# EAGLE design wirelessnode (EAGLE 6.5.0)
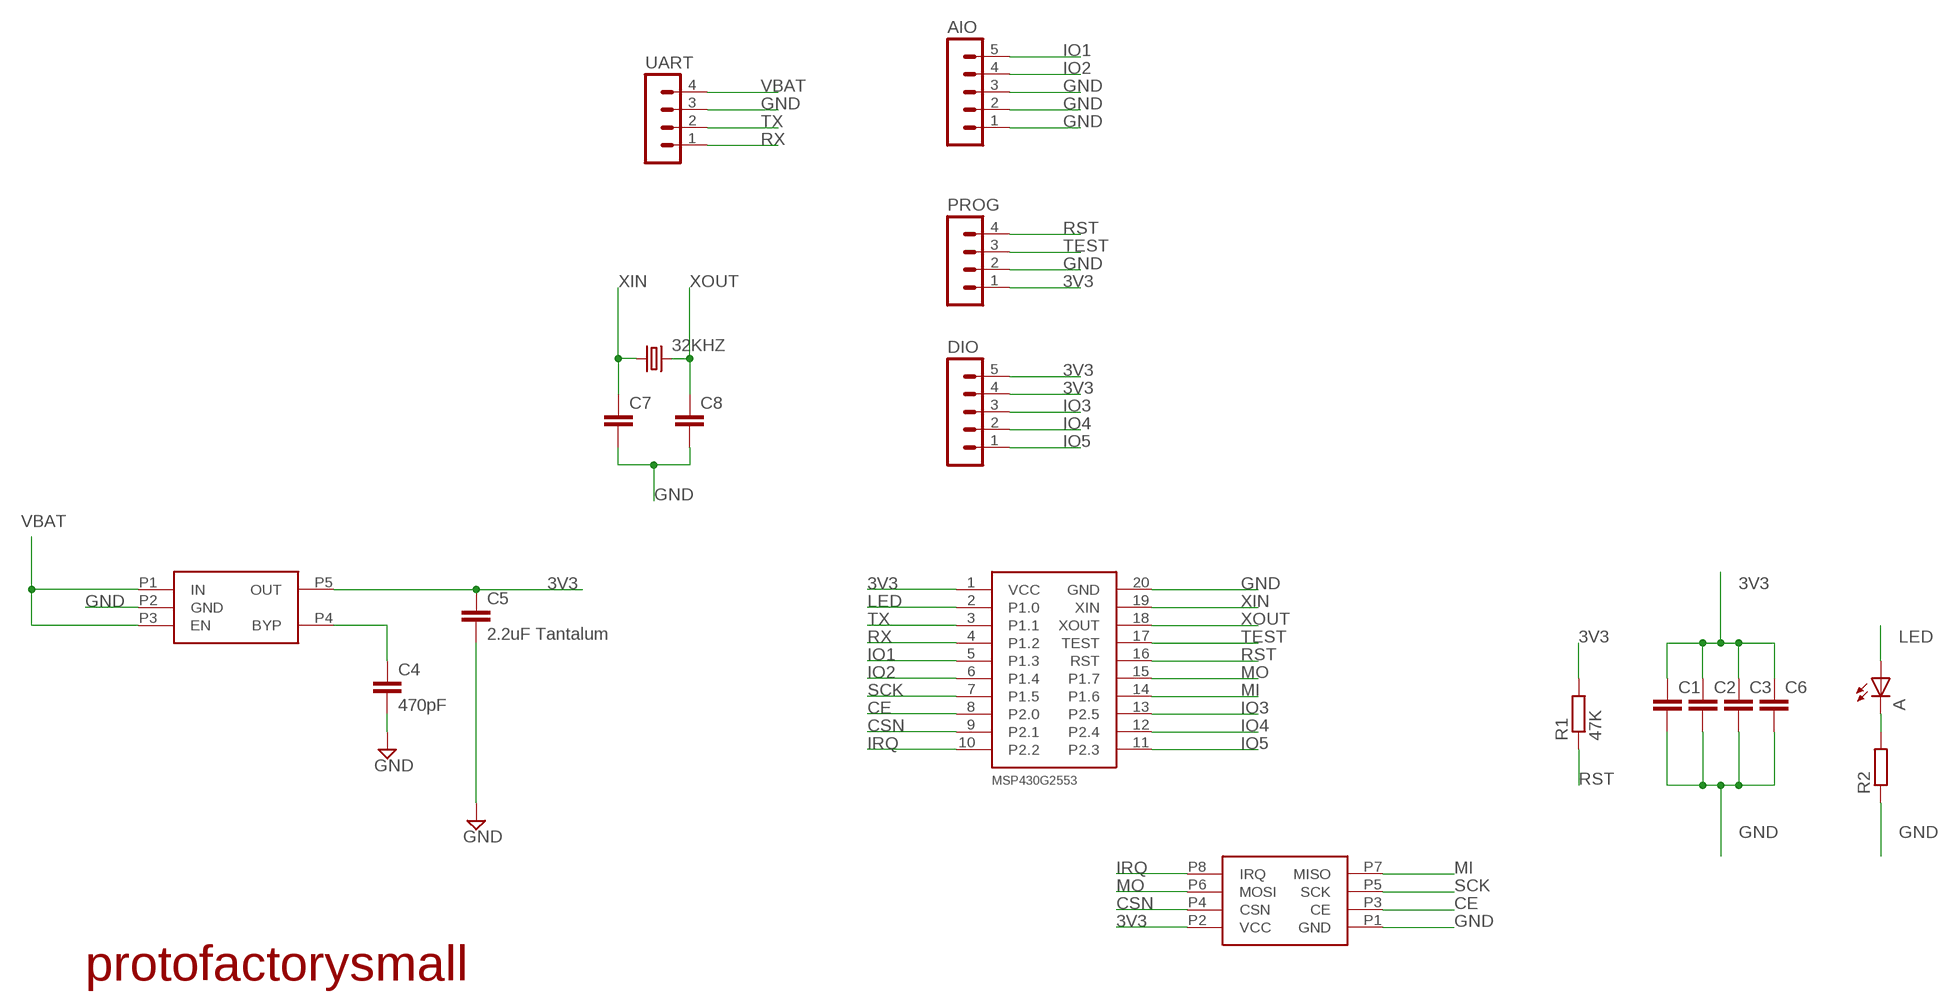
[diagram p0: schematic, sheet 1]

## Parts
32KHZ  CRYSTALTC26H  [TC26H]
A  LEDSML0603  [SML0603]
AIO  MA05-1  [MA05-1]
C1  C-EUC0603  [C0603]
C2  C-EUC0603  [C0603]
C3  C-EUC0603  [C0603]
C4  470pF  C-EUC0603  [C0603]
C5  2.2uF Tantalum  C-EUC3225  [C3225]
C6  C-EUC0603  [C0603]
C7  C-EUC0603  [C0603]
C8  C-EUC0603  [C0603]
DIO  MA05-1  [MA05-1]
MSP430G2553  MSP430G2553_20PINMSP430G2553  [DIL20]
PROG  MA04-1  [MA04-1]
R1  47K  R-EU_R0603  [R0603]
R2  R-EU_R0603  [R0603]
RF  NRF24L01NRF24L01  [NRF24L01]
U$1  SMALLPROTOLOGOLOGO  [LOGO_SMALL]
U$3  MIC5219-X.XBM5MIC5219-3.3YM5TR  [SOT-23-5]
UART  MA04-1  [MA04-1]

## Nets
3V3: C1.1 C2.1 C3.1 C5.1 C6.1 DIO.4 DIO.5 MSP430G2553.1(VCC) PROG.1 R1.2 RF.P2(VCC) U$3.P5(OUT)
CE: MSP430G2553.8(P2.0) RF.P3(CE)
CSN: MSP430G2553.9(P2.1) RF.P4(CSN)
GND: AIO.1 AIO.2 AIO.3 C1.2 C2.2 C3.2 C4.2 C5.2 C6.2 C7.2 C8.2 MSP430G2553.20(GND) PROG.2 R2.1 RF.P1(GND) U$3.P2(GND) UART.3
IO1: AIO.5 MSP430G2553.5(P1.3)
IO2: AIO.4 MSP430G2553.6(P1.4)
IO3: DIO.3 MSP430G2553.13(P2.5)
IO4: DIO.2 MSP430G2553.12(P2.4)
IO5: DIO.1 MSP430G2553.11(P2.3)
IRQ: MSP430G2553.10(P2.2) RF.P8(IRQ)
LED: A.A MSP430G2553.2(P1.0)
MI: MSP430G2553.14(P1.6) RF.P7(MISO)
MO: MSP430G2553.15(P1.7) RF.P6(MOSI)
N$2: A.C R2.2
N$3: C4.1 U$3.P4(BYP)
RST: MSP430G2553.16(RST) PROG.4 R1.1
RX: MSP430G2553.4(P1.2) UART.1
SCK: MSP430G2553.7(P1.5) RF.P5(SCK)
TEST: MSP430G2553.17(TEST) PROG.3
TX: MSP430G2553.3(P1.1) UART.2
VBAT: U$3.P1(IN) U$3.P3(EN) UART.4
XIN: 32KHZ.1 C7.1 MSP430G2553.19(XIN)
XOUT: 32KHZ.2 C8.1 MSP430G2553.18(XOUT)

## Library data of the parts
32KHZ = crystal:CRYSTAL: CRYSTAL; OC_FARNELL: unknown; OC_NEWARK: unknown
A = led:LED: LED OSRAM: - CHIPLED LG R971, LG N971, LY N971, LG Q971, LY Q971, LO R971, LY R971 LH N974, LH R974 LS Q976, LO Q976, LY Q976 LO Q996 - Hyper CHIPLED LW Q18S LB Q993, LB Q99A, LB R99A - SideLED LS A670, LO A670, LY A670, LG A670, LP A670 LB A673, LV A673, LT A673, LW A673 LH A674 LY A675 LS A676, LA A676, LO A676, LY A676, LW A676 LS A679, LY A679, LG A679 - Hyper Micro SIDELED® LS Y876, LA Y876, LO Y876, LY Y876 LT Y87S - SmartLED LW L88C, LW L88S LB L89C, LB L89S, LG L890 LS L89K, LO L89K, LY L89K LS L896, LA L896, LO L896, LY L896 - TOPLED LS T670, LO T670, LY T670, LG T670, LP T670 LSG T670, LSP T670, LSY T670, LOP T670, LYG T670 LG T671, LOG T671, LSG T671 LB T673, LV T673, LT T673, LW T673 LH T674 LS T676, LA T676, LO T676, LY T676, LB T676, LH T676, LSB T676, LW T676 LB T67C, LV T67C, LT T67C, LS T67K, LO T67K, LY T67K, LW E67C LS E67B, LA E67B, LO E67B, LY E67B, LB E67C, LV E67C, LT E67C LW T67C LS T679, LY T679, LG T679 LS T770, LO T770, LY T770, LG T770, LP T770 LB T773, LV T773, LT T773, LW T773 LH T774 LS E675, LA E675, LY E675, LS T675 LS T776, LA T776, LO T776, LY T776, LB T776 LHGB T686 LT T68C, LB T68C - Hyper Mini TOPLED® LB M676 - Mini TOPLED Santana® LG M470 LS M47K, LO M47K, LY M47K Source: http://www.osram.convergy.de LUXEON: - LUMILED® LXK2-PW12-R00, LXK2-PW12-S00, LXK2-PW14-U00, LXK2-PW14-V00 LXK2-PM12-R00, LXK2-PM12-S00, LXK2-PM14-U00 LXK2-PE12-Q00, LXK2-PE12-R00, LXK2-PE12-S00, LXK2-PE14-T00, LXK2-PE14-U00 LXK2-PB12-K00, LXK2-PB12-L00, LXK2-PB12-M00, LXK2-PB14-N00, LXK2-PB14-P00, LXK2-PB14-Q00 LXK2-PR12-L00, LXK2-PR12-M00, LXK2-PR14-Q00, LXK2-PR14-R00 LXK2-PD12-Q00, LXK2-PD12-R00, LXK2-PD12-S00 LXK2-PH12-R00, LXK2-PH12-S00 LXK2-PL12-P00, LXK2-PL12-Q00, LXK2-PL12-R00 Source: www.luxeon.com KINGBRIGHT: KA-3528ASYC Source: www.kingbright.com
AIO DIO = con-lstb:MA05-1: PIN HEADER; OC_FARNELL: unknown; OC_NEWARK: unknown
C1-C8 = rcl:C-EU: CAPACITOR, European symbol
MSP430G2553 = protofactory:MSP430G2553_20PIN
PROG UART = con-lstb:MA04-1: PIN HEADER; OC_FARNELL: unknown; OC_NEWARK: unknown
R1 R2 = rcl:R-EU_: RESISTOR, European symbol
RF = protofactory:NRF24L01
U$1 = protofactory:SMALLPROTOLOGO
U$3 = protofactory:MIC5219-X.XBM5: 3.3V LDO

## Board
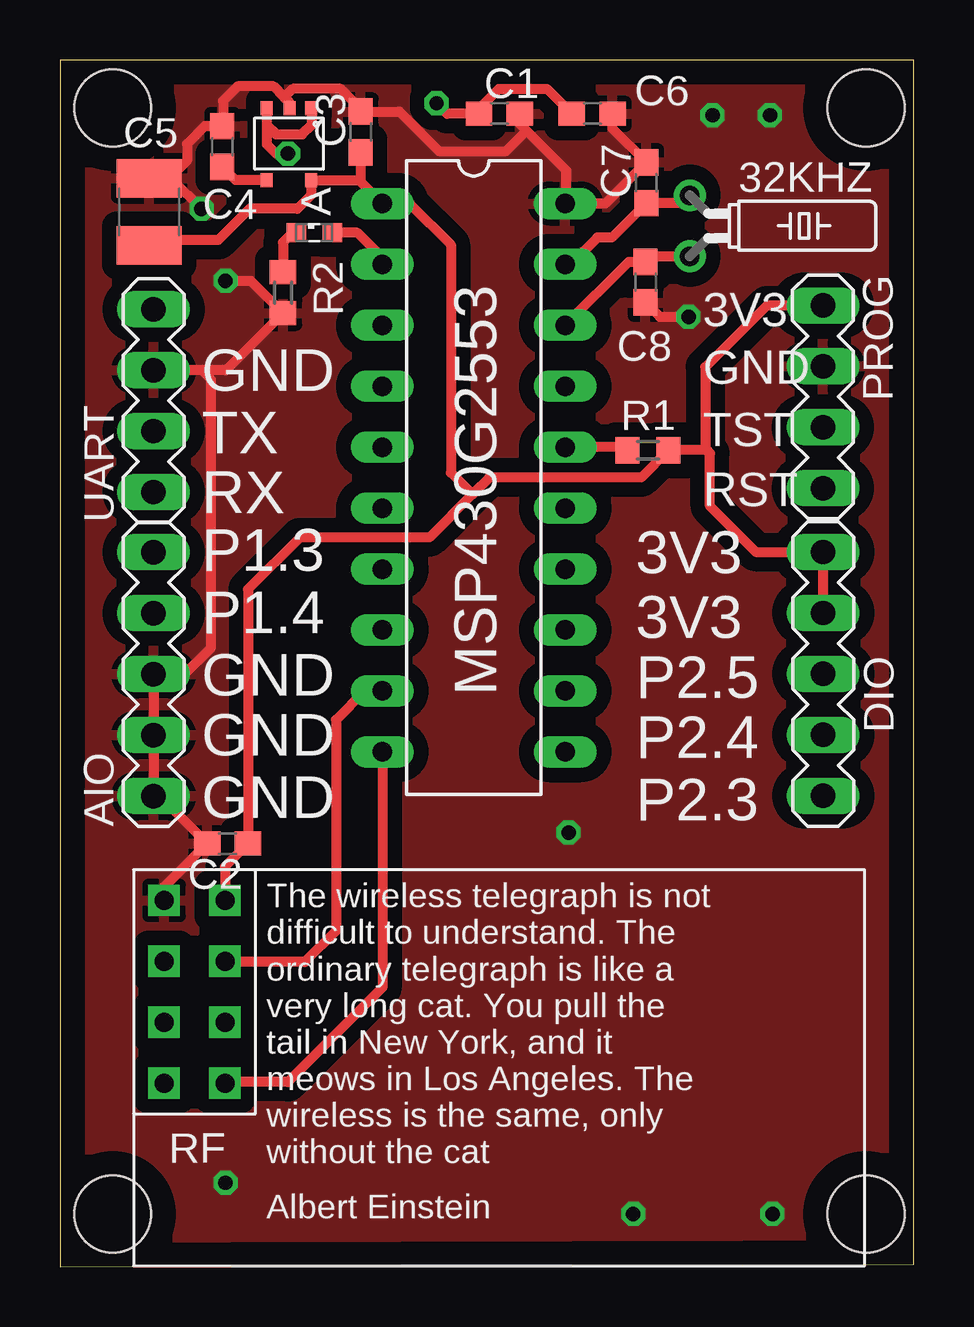
[diagram p1: board, top side]
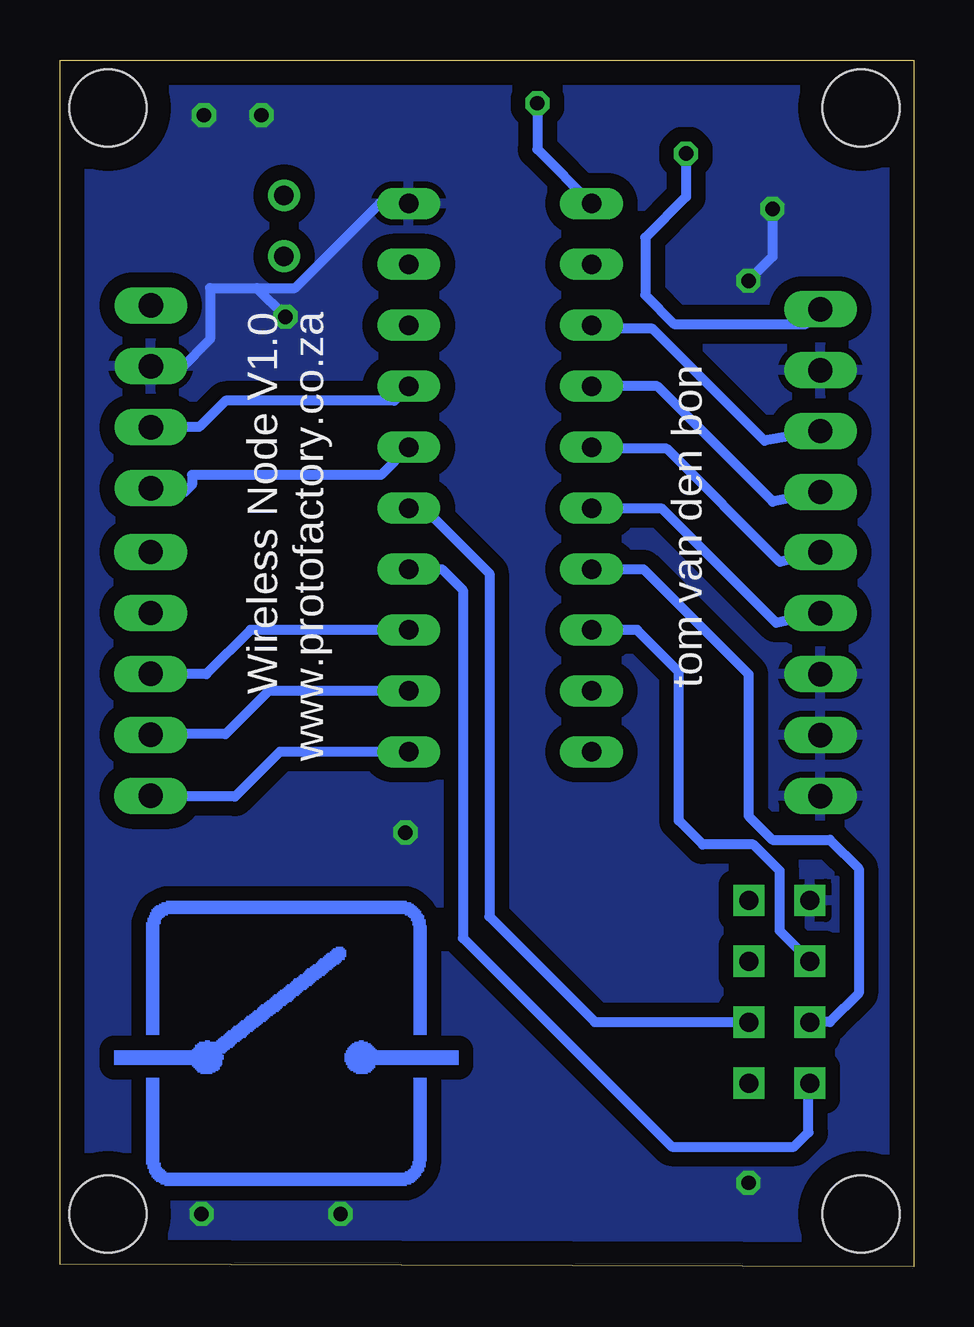
[diagram p2: board, bottom side, seen from below]

Size 35.6 x 50.3 mm. Coordinates in mm from the lower left corner, seen from the top.
Outline: 0,0 35.6,0.1 35.6,50.3 0,50.3 0,0
Copper layers (1*16): Top 0.035mm / dielectric 1.5mm / Bottom 0.035mm
Design rules "default": minimum track width 10mil, minimum drill 24mil, track to track 8mil, track to pad 8mil, pad to pad 8mil, via to via 8mil, smd to smd 8mil, copper to edge 40mil, drill to drill 8mil, minimum pad ring 10mil, minimum via ring 8mil, stop-mask expansion 4mil, vias tented up to drill 0mil, thermal gap 10mil
Holes 3.2 mm at 2.2,48.3 33.6,48.3 33.6,2.2 2.2,2.2

### Footprints (pad centres in the part's own frame; a part is rotated, then mirrored left to right if it is on the bottom)
TC26H = drill 0.813: 1 -1.27,0; 2 1.27,0
SML0603 = smd 0.8 x 0.8: A 0.75,0; C -0.75,0
MA05-1 = drill 1.016 long: 1 -5.08,0; 2 -2.54,0; 3 0,0; 4 2.54,0; 5 5.08,0
C0603 = smd 1.1 x 1: 1 -0.85,0; 2 0.85,0
C3225 = smd 1.6 x 2.7: 1 -1.4,0; 2 1.4,0
DIL20 = drill 0.813 long: 1 -11.43,-3.81; 2 -8.89,-3.81; 3 -6.35,-3.81; 4 -3.81,-3.81; 5 -1.27,-3.81; 6 1.27,-3.81; 7 3.81,-3.81; 8 6.35,-3.81; 9 8.89,-3.81; 10 11.43,-3.81; 11 11.43,3.81; 12 8.89,3.81; 13 6.35,3.81; 14 3.81,3.81; 15 1.27,3.81; 16 -1.27,3.81; 17 -3.81,3.81; 18 -6.35,3.81; 19 -8.89,3.81; 20 -11.43,3.81
MA04-1 = drill 1.016 long: 1 -3.81,0; 2 -1.27,0; 3 1.27,0; 4 3.81,0
R0603 = smd 1 x 1.1: 1 -0.85,0; 2 0.85,0
NRF24L01 = drill 0.8 square: P1 0,0; P2 -2.54,0; P3 0,2.54; P4 -2.54,2.54; P5 0,5.08; P6 -2.54,5.08; P7 0,7.62; P8 -2.54,7.62
SOT-23-5 = smd 0.5 x 0.6: P1 0.2,0.25; P2 1.1,0.25; P3 2.05,0.25; P4 2.05,3.25; P5 0.2,3.25

### Placement (x,y rotation side)
32KHZ  26.26,43.39 270 top
A  10.6,43.1 0 top
AIO  3.9,24.7 90 top
C1  18.32,48.06 0 top
C2  6.99,17.64 180 top
C3  12.54,47.3 90 top
C4  6.77,46.69 90 top
C5  3.72,43.97 90 top
C6  22.19,48.06 0 top
C7  24.44,45.18 90 top
C8  24.41,41.04 270 top
DIO  31.82,24.71 90 top
MSP430G2553  17.25,32.89 270 top
PROG  31.81,36.26 270 top
R1  24.51,34.03 0 top
R2  9.3,40.6 90 top
RF  4.34,15.27 180 top
U$1  33.3,3.4 0 bottom
U$3  10.67,48.54 180 top
UART  3.9,36.1 90 top

### Tracks (layer width: path | path; a pad name or v marks a point on that pad's centre or on a via)
3V3  (via drill 0.6)
  Top 0.406: 26.97,34.03 R1.2 24.23,32.9 17.9,32.9 17.2,32.2 | 17.2,32.2 15.4,30.4 10,30.4 7.84,28.24 C2.1 6.88,16.68 RF.P2 | C6.1 20.3,49.1 18.3,49.1 17.47,48.27 C1.1 16.14,48.06 v15.7,48.5 | C3.1 12.54,45.22 | 12.54,45.22 MSP430G2553.1 14.58,44.32 16.3,42.6 16.3,33.1 17.2,32.2 | 12.54,45.22 12.47,45.29 U$3.P5 10.47,44.67 9.9,44.1 7.9,44.1 6.6,42.8 3.75,42.8 C5.1 | DIO.4 DIO.5 29,29.8 27.1,31.7 27.1,33.9 26.97,34.03 | PROG.1 29.47,40.07 26.9,37.5 26.9,34.1 26.97,34.03
  Bottom 0.406: v15.7,48.5 15.7,46.58 MSP430G2553.1
CE
  Bottom 0.406: RF.P3 5.6,14 5.6,16.5 6.7,17.6 8.8,17.6 9.8,18.6 9.8,24.8 11.54,26.54 MSP430G2553.8
CSN
  Top 0.406: MSP430G2553.9 12.7,24 11.5,22.8 11.5,14 10.2,12.7 6.91,12.7 RF.P4
GND  (via drill 0.6)
  Top 0.406: RF.P1 4.34,15.84 C2.2 4.16,19.62 AIO.1 AIO.2 AIO.3 5.2,24.7 6.3,25.8 6.3,36.97 5.9,37.37 | C8.2 25,39.6 v26.2,39.6 | C6.2 23.04,47.43 C7.2 22.73,44.32 MSP430G2553.20 21.1,44.36 21.1,45.7 19.45,47.35 | C1.2 19.17,47.63 19.45,47.35 | 19.45,47.35 18.6,46.5 15.8,46.5 14.15,48.15 C3.2 12.54,48.26 11.7,49.1 9.7,49.1 9.35,48.75 | 5.9,37.37 6.92,37.37 R2.1 7.95,41.1 v6.9,41.1 | 5.9,37.37 UART.3 | U$3.P2 9.57,48.53 9.35,48.75 | 9.35,48.75 8.9,49.2 7.4,49.2 6.8,48.6 6.8,47.57 C4.2 6.04,47.54 5.3,46.8 5.3,46.1 4.7,45.5 | 4.7,45.5 3.79,45.5 C5.2 | 4.7,45.5 4.7,45.3 v5.9,44.1
  Bottom 0.406: 27.4,40.8 29.34,40.8 29.34,38.66 30.6,37.4 31.68,37.4 PROG.2 | 27.4,40.8 25.8,40.8 22.28,44.32 MSP430G2553.20 | v26.2,39.6 27.4,40.8 | v5.9,44.1 5.9,42.1 v6.9,41.1
  other vias: 23.9,2.2 29.7,2.2 21.2,18.1 27.2,48 29.6,48 6.9,3.5
  pour Bottom (isolate 0.61): -0.6,51.1 36.3,51.1 36.3,-1.4 -0.6,-1.4
  pour Top (isolate 0.61): -1,51.2 36.5,51.2 36.5,-1.4 -1,-1.4
IO1
  Bottom 0.406: AIO.5 5.58,29.38 10.3,34.1 13.38,34.1 MSP430G2553.5
IO2
  Bottom 0.406: AIO.4 5.74,26.84 10.5,31.6 13.42,31.6 MSP430G2553.6
IO3
  Bottom 0.406: MSP430G2553.13 27.66,26.54 29.5,24.7 DIO.3
IO4
  Bottom 0.406: MSP430G2553.12 26.9,24 28.7,22.2 31.79,22.2 DIO.2
IO5
  Bottom 0.406: MSP430G2553.11 26.44,21.46 28.3,19.6 31.79,19.6 DIO.1
IRQ
  Top 0.406: MSP430G2553.10 13.44,11.64 9.5,7.7 6.93,7.7 RF.P8
LED
  Top 0.406: MSP430G2553.2 13.44,42.06 12.4,43.1 A.A
MI
  Bottom 0.406: MSP430G2553.14 19.68,29.08 18.8,28.2 18.8,13.7 10.1,5 5,5 4.4,5.6 4.4,7.59 RF.P7
MO
  Bottom 0.406: MSP430G2553.15 20.42,31.62 17.7,28.9 17.7,14.6 13.3,10.2 RF.P6
N$2
  Top 0.406: A.C 9.7,43.1 9.3,42.7 R2.2
N$3
  Top 0.406: U$3.P4 7.32,45.29 C4.1
RST
  Top 0.406: R1.1 23.53,34.16 MSP430G2553.16
  Bottom 0.406: MSP430G2553.16 22.22,33 30.1,33 30.1,32.6 30.4,32.3 31.66,32.3 PROG.4
RX
  Bottom 0.406: UART.1 5.89,31.89 10.7,36.7 MSP430G2553.4
SCK
  Bottom 0.406: MSP430G2553.7 11.28,29.08 6.9,24.7 6.9,18.8 5.9,17.8 3.5,17.8 2.3,16.6 2.3,11.4 3.5,10.2 RF.P5
TEST
  Bottom 0.406: MSP430G2553.17 21.66,36.1 28.7,36.1 29.8,35 PROG.3
TX
  Bottom 0.406: UART.2 6.23,34.43 10.9,39.1 13.3,39.1 MSP430G2553.3
VBAT  (via drill 0.6)
  Top 0.406: U$3.P1 10.5,48.26 10.5,47.6 10.1,47.2 9,47.2 8.62,47.58 U$3.P3 8.62,46.78 9,46.4 v9.5,46.4
  Bottom 0.406: v9.5,46.4 9.5,44.6 11.2,42.9 11.2,40.5 10,39.3 4.51,39.3 UART.4
XIN
  Top 0.406: 32KHZ.1 25.93,44.33 C7.1 23.01,42.9 22.4,42.9 21.28,41.78 MSP430G2553.19
XOUT
  Top 0.406: MSP430G2553.18 23.71,41.89 C8.1 24.64,42.12 32KHZ.2

### Text on the board
tNames: 3V3 | GND | GND | TX | TST | RST | RX | P1.3 | 3V3 | P1.4 | 3V3 | GND | P2.5 | GND | P2.4 | GND | P2.3 | The wireless telegraph is not / difficult to understand. The / ordinary telegraph is like a / very long cat. You pull the / tail in New York, and it / meows in Los Angeles. The / wireless is the same, only / without the cat | Albert Einstein
bNames: Wireless Node V1.0 / www.protofactory.co.za | tom van den bon